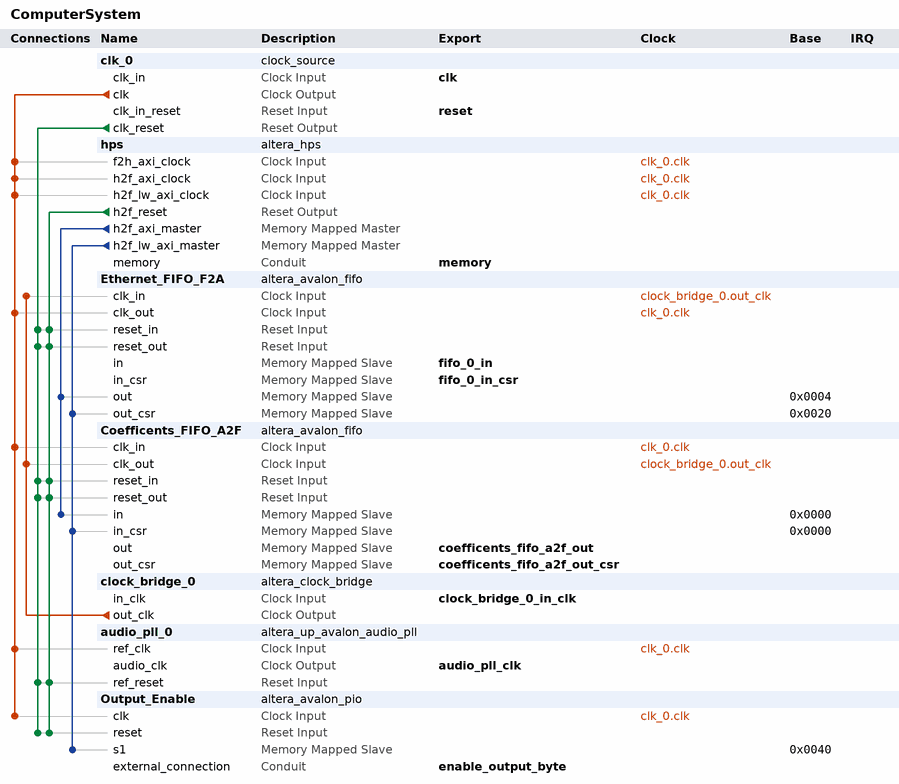
[diagram p0: system contents]
# Platform Designer (Qsys) system ComputerSystem, Cyclone V 5CSEMA4U23C6
# Parameters at their usual value, and those the tool derives, are not listed.
package require -exact qsys 19.1
create_system ComputerSystem
set_project_property DEVICE_FAMILY {Cyclone V}
set_project_property DEVICE 5CSEMA4U23C6

add_instance clk_0 clock_source 19.1
set_instance_parameter_value clk_0 clockFrequency 50000000

add_instance hps altera_hps 19.1
set_instance_parameter_value hps EMAC1_Mode N/A
set_instance_parameter_value hps EMAC1_PinMuxing Unused
set_instance_parameter_value hps F2SCLK_COLDRST_Enable false
set_instance_parameter_value hps F2SCLK_DBGRST_Enable false
set_instance_parameter_value hps F2SCLK_WARMRST_Enable false
set_instance_parameter_value hps F2SINTERRUPT_Enable false
set_instance_parameter_value hps F2S_Width 3
set_instance_parameter_value hps FPGA_PERIPHERAL_OUTPUT_CLOCK_FREQ_EMAC0_GTX_CLK 125
set_instance_parameter_value hps FPGA_PERIPHERAL_OUTPUT_CLOCK_FREQ_EMAC0_MD_CLK 2.5
set_instance_parameter_value hps FPGA_PERIPHERAL_OUTPUT_CLOCK_FREQ_EMAC1_GTX_CLK 125
set_instance_parameter_value hps FPGA_PERIPHERAL_OUTPUT_CLOCK_FREQ_EMAC1_MD_CLK 2.5
set_instance_parameter_value hps HPS_PROTOCOL DDR3
set_instance_parameter_value hps I2C0_Mode N/A
set_instance_parameter_value hps I2C0_PinMuxing Unused
set_instance_parameter_value hps I2C1_Mode N/A
set_instance_parameter_value hps I2C1_PinMuxing Unused
set_instance_parameter_value hps LWH2F_Enable true
set_instance_parameter_value hps MEM_BANKADDR_WIDTH 3
set_instance_parameter_value hps MEM_CLK_FREQ 400.0
set_instance_parameter_value hps MEM_COL_ADDR_WIDTH 10
set_instance_parameter_value hps MEM_DQ_WIDTH 32
set_instance_parameter_value hps MEM_DRV_STR RZQ/6
set_instance_parameter_value hps MEM_ROW_ADDR_WIDTH 15
set_instance_parameter_value hps MEM_RTT_NOM RZQ/6
set_instance_parameter_value hps MEM_RTT_WR {Dynamic ODT off}
set_instance_parameter_value hps MEM_TCL 7
set_instance_parameter_value hps MEM_TFAW_NS 37.5
set_instance_parameter_value hps MEM_TINIT_US 499
set_instance_parameter_value hps MEM_TMRD_CK 3
set_instance_parameter_value hps MEM_TRAS_NS 40.0
set_instance_parameter_value hps MEM_TRCD_NS 15.0
set_instance_parameter_value hps MEM_TREFI_US 7.0
set_instance_parameter_value hps MEM_TRFC_NS 75.0
set_instance_parameter_value hps MEM_TRP_NS 15.0
set_instance_parameter_value hps MEM_TWTR 2
set_instance_parameter_value hps MEM_VENDOR Other
set_instance_parameter_value hps MEM_WTCL 7
set_instance_parameter_value hps QSPI_Mode N/A
set_instance_parameter_value hps QSPI_PinMuxing Unused
set_instance_parameter_value hps REF_CLK_FREQ 25.0
set_instance_parameter_value hps S2FCLK_USER2CLK 5
set_instance_parameter_value hps S2F_Width 2
set_instance_parameter_value hps SDIO_Mode N/A
set_instance_parameter_value hps SDIO_PinMuxing Unused
set_instance_parameter_value hps SPIM1_Mode N/A
set_instance_parameter_value hps SPIM1_PinMuxing Unused
set_instance_parameter_value hps STM_Enable false
set_instance_parameter_value hps TIMING_BOARD_AC_SKEW 0.02
set_instance_parameter_value hps TIMING_BOARD_AC_TO_CK_SKEW 0.0
set_instance_parameter_value hps TIMING_BOARD_DQ_TO_DQS_SKEW 0.0
set_instance_parameter_value hps TIMING_BOARD_MAX_CK_DELAY 0.6
set_instance_parameter_value hps TIMING_BOARD_MAX_DQS_DELAY 0.6
set_instance_parameter_value hps TIMING_BOARD_SKEW_BETWEEN_DQS 0.02
set_instance_parameter_value hps TIMING_BOARD_SKEW_CKDQS_DIMM_MAX 0.01
set_instance_parameter_value hps TIMING_BOARD_SKEW_CKDQS_DIMM_MIN -0.01
set_instance_parameter_value hps TIMING_BOARD_SKEW_WITHIN_DQS 0.02
set_instance_parameter_value hps TIMING_TDH 125
set_instance_parameter_value hps TIMING_TDQSCK 400
set_instance_parameter_value hps TIMING_TDQSQ 120
set_instance_parameter_value hps TIMING_TDS 50
set_instance_parameter_value hps TIMING_TIH 250
set_instance_parameter_value hps TIMING_TIS 175
set_instance_parameter_value hps TIMING_TQSH 0.38
set_instance_parameter_value hps UART0_Mode N/A
set_instance_parameter_value hps UART0_PinMuxing Unused
set_instance_parameter_value hps USB1_Mode N/A
set_instance_parameter_value hps USB1_PinMuxing Unused
set_instance_parameter_value hps desired_cfg_clk_mhz 100.0
set_instance_parameter_value hps desired_qspi_clk_mhz 400.0

add_instance Ethernet_FIFO_F2A altera_avalon_fifo 19.1
set_instance_parameter_value Ethernet_FIFO_F2A bitsPerSymbol 16
set_instance_parameter_value Ethernet_FIFO_F2A channelWidth 8
set_instance_parameter_value Ethernet_FIFO_F2A errorWidth 8
set_instance_parameter_value Ethernet_FIFO_F2A fifoDepth 256
set_instance_parameter_value Ethernet_FIFO_F2A fifoInputInterfaceOptions AVALONMM_WRITE
set_instance_parameter_value Ethernet_FIFO_F2A fifoOutputInterfaceOptions AVALONMM_READ
set_instance_parameter_value Ethernet_FIFO_F2A singleClockMode false
set_instance_parameter_value Ethernet_FIFO_F2A symbolsPerBeat 2
set_instance_parameter_value Ethernet_FIFO_F2A useBackpressure false
set_instance_parameter_value Ethernet_FIFO_F2A useIRQ false
set_instance_parameter_value Ethernet_FIFO_F2A usePacket true
set_instance_parameter_value Ethernet_FIFO_F2A useReadControl true

add_instance Coefficents_FIFO_A2F altera_avalon_fifo 19.1
set_instance_parameter_value Coefficents_FIFO_A2F bitsPerSymbol 16
set_instance_parameter_value Coefficents_FIFO_A2F channelWidth 8
set_instance_parameter_value Coefficents_FIFO_A2F errorWidth 8
set_instance_parameter_value Coefficents_FIFO_A2F fifoDepth 256
set_instance_parameter_value Coefficents_FIFO_A2F fifoInputInterfaceOptions AVALONMM_WRITE
set_instance_parameter_value Coefficents_FIFO_A2F fifoOutputInterfaceOptions AVALONMM_READ
set_instance_parameter_value Coefficents_FIFO_A2F singleClockMode false
set_instance_parameter_value Coefficents_FIFO_A2F symbolsPerBeat 2
set_instance_parameter_value Coefficents_FIFO_A2F useBackpressure false
set_instance_parameter_value Coefficents_FIFO_A2F useIRQ false
set_instance_parameter_value Coefficents_FIFO_A2F usePacket true
set_instance_parameter_value Coefficents_FIFO_A2F useReadControl true

add_instance clock_bridge_0 altera_clock_bridge 19.1
set_instance_parameter_value clock_bridge_0 DERIVED_CLOCK_RATE 0
set_instance_parameter_value clock_bridge_0 EXPLICIT_CLOCK_RATE 50000000

add_instance audio_pll_0 altera_up_avalon_audio_pll 18.0
set_instance_parameter_value audio_pll_0 gui_refclk 50.0

add_instance Output_Enable altera_avalon_pio 19.1
set_instance_parameter_value Output_Enable direction Output
set_instance_parameter_value Output_Enable width 8

# connections
add_connection clk_0.clk audio_pll_0.ref_clk clock
add_connection clk_0.clk Coefficents_FIFO_A2F.clk_in clock
add_connection clk_0.clk Ethernet_FIFO_F2A.clk_out clock
add_connection clk_0.clk hps.f2h_axi_clock clock
add_connection clk_0.clk hps.h2f_axi_clock clock
add_connection clk_0.clk hps.h2f_lw_axi_clock clock
add_connection clk_0.clk Output_Enable.clk clock
add_connection clock_bridge_0.out_clk Coefficents_FIFO_A2F.clk_out clock
add_connection clock_bridge_0.out_clk Ethernet_FIFO_F2A.clk_in clock
add_connection clk_0.clk_reset audio_pll_0.ref_reset reset
add_connection clk_0.clk_reset Coefficents_FIFO_A2F.reset_in reset
add_connection clk_0.clk_reset Coefficents_FIFO_A2F.reset_out reset
add_connection clk_0.clk_reset Ethernet_FIFO_F2A.reset_in reset
add_connection clk_0.clk_reset Ethernet_FIFO_F2A.reset_out reset
add_connection clk_0.clk_reset Output_Enable.reset reset
add_connection hps.h2f_reset audio_pll_0.ref_reset reset
add_connection hps.h2f_reset Coefficents_FIFO_A2F.reset_in reset
add_connection hps.h2f_reset Coefficents_FIFO_A2F.reset_out reset
add_connection hps.h2f_reset Ethernet_FIFO_F2A.reset_in reset
add_connection hps.h2f_reset Ethernet_FIFO_F2A.reset_out reset
add_connection hps.h2f_reset Output_Enable.reset reset
add_connection hps.h2f_axi_master Coefficents_FIFO_A2F.in avalon
set_connection_parameter_value hps.h2f_axi_master/Coefficents_FIFO_A2F.in baseAddress 0x0000
add_connection hps.h2f_axi_master Ethernet_FIFO_F2A.out avalon
set_connection_parameter_value hps.h2f_axi_master/Ethernet_FIFO_F2A.out baseAddress 0x0004
add_connection hps.h2f_lw_axi_master Coefficents_FIFO_A2F.in_csr avalon
set_connection_parameter_value hps.h2f_lw_axi_master/Coefficents_FIFO_A2F.in_csr baseAddress 0x0000
add_connection hps.h2f_lw_axi_master Ethernet_FIFO_F2A.out_csr avalon
set_connection_parameter_value hps.h2f_lw_axi_master/Ethernet_FIFO_F2A.out_csr baseAddress 0x0020
add_connection hps.h2f_lw_axi_master Output_Enable.s1 avalon
set_connection_parameter_value hps.h2f_lw_axi_master/Output_Enable.s1 baseAddress 0x0040

# exported interfaces
add_interface audio_pll_clk clock source
set_interface_property audio_pll_clk EXPORT_OF audio_pll_0.audio_clk
add_interface clk clock sink
set_interface_property clk EXPORT_OF clk_0.clk_in
add_interface clock_bridge_0_in_clk clock sink
set_interface_property clock_bridge_0_in_clk EXPORT_OF clock_bridge_0.in_clk
add_interface coefficents_fifo_a2f_out avalon slave
set_interface_property coefficents_fifo_a2f_out EXPORT_OF Coefficents_FIFO_A2F.out
add_interface coefficents_fifo_a2f_out_csr avalon slave
set_interface_property coefficents_fifo_a2f_out_csr EXPORT_OF Coefficents_FIFO_A2F.out_csr
add_interface enable_output_byte conduit end
set_interface_property enable_output_byte EXPORT_OF Output_Enable.external_connection
add_interface fifo_0_in avalon slave
set_interface_property fifo_0_in EXPORT_OF Ethernet_FIFO_F2A.in
add_interface fifo_0_in_csr avalon slave
set_interface_property fifo_0_in_csr EXPORT_OF Ethernet_FIFO_F2A.in_csr
add_interface memory conduit end
set_interface_property memory EXPORT_OF hps.memory
add_interface reset reset sink
set_interface_property reset EXPORT_OF clk_0.clk_in_reset

set_interconnect_requirement {$system} qsys_mm.clockCrossingAdapter HANDSHAKE
set_interconnect_requirement {$system} qsys_mm.enableEccProtection FALSE
set_interconnect_requirement {$system} qsys_mm.insertDefaultSlave FALSE
set_interconnect_requirement {$system} qsys_mm.maxAdditionalLatency 1

save_system ComputerSystem.qsys
